# EAGLE design temperatur_sensor_childboard_v1 (EAGLE 6.3)
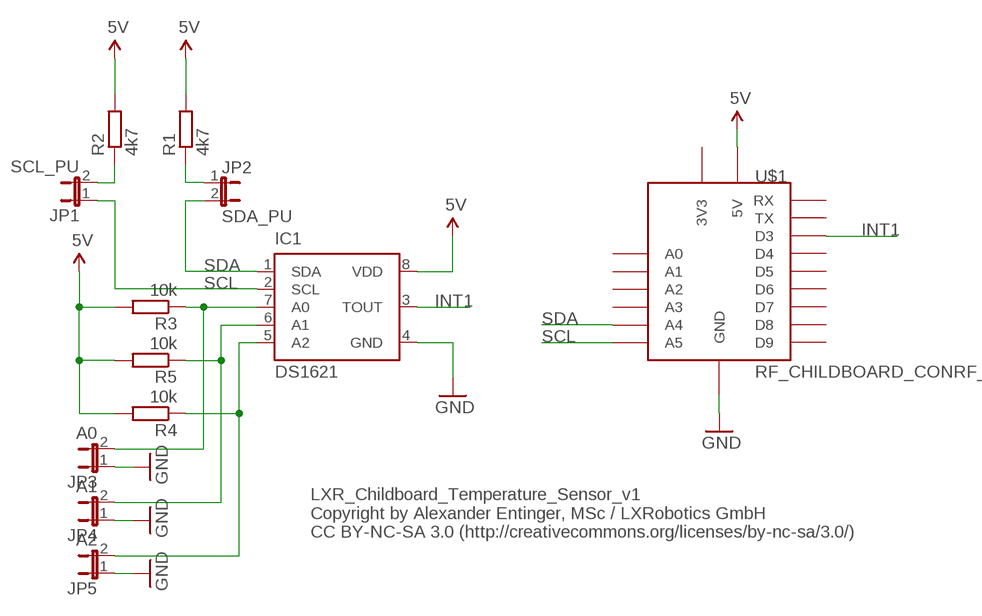
[diagram p0: schematic, sheet 1]

## Parts
IC1  DS1621  [DIL08]
JP1  SCL_PU  JP1E  [JP1]
JP2  SDA_PU  JP1E  [JP1]
JP3  A0  JP1E  [JP1]
JP4  A1  JP1E  [JP1]
JP5  A2  JP1E  [JP1]
R1  4k7  R-EU_0207/7  [0207/7]
R2  4k7  R-EU_0207/7  [0207/7]
R3  10k  R-EU_0207/7  [0207/7]
R4  10k  R-EU_0207/7  [0207/7]
R5  10k  R-EU_0207/7  [0207/7]
U$1  RF_CHILDBOARD_CONRF_C  [RF_CHILDBOARD_CON]

## Nets
5V: IC1.8(VDD) R1.2 R2.2 R3.2 R4.2 R5.2 U$1.5V
GND: IC1.4(GND) JP3.1 JP4.1 JP5.1 U$1.GND U$1.GND1(GND) U$1.GND2(GND)
INT1: IC1.3(TOUT) U$1.D3
N$1: JP1.2 R2.1
N$2: IC1.7(A0) JP3.2 R3.1
N$3: JP2.1 R1.1
N$4: IC1.6(A1) JP4.2 R5.1
N$5: IC1.5(A2) JP5.2 R4.1
SCL: IC1.2(SCL) JP1.1 U$1.A5
SDA: IC1.1(SDA) JP2.2 U$1.A4
Unconnected: U$1.3V3 U$1.A0 U$1.A1 U$1.A2 U$1.A3 U$1.D4 U$1.D5 U$1.D6 U$1.D7 U$1.D8 U$1.D9 U$1.RX U$1.TX

## Notes on the sheet
- LXR_Childboard_Temperature_Sensor_v1
  Copyright by Alexander Entinger, MSc / LXRobotics GmbH
  CC BY-NC-SA 3.0 (http://creativecommons.org/licenses/by-nc-sa/3.0/)

## Library data of the parts
IC1 = maxim:DS1621: Digital Thermometer and Thermostat Source: http://pdfserv.maxim-ic.com/en/ds/DS1621.pdf; MPN: DS1621; OC_FARNELL: 1188024; OC_NEWARK: 66F3769
JP1-JP5 = jumper:JP1E: JUMPER
R1-R5 = resistor:R-EU_: RESISTOR, European symbol
U$1 = lxrobotics:RF_CHILDBOARD_CON

## Board
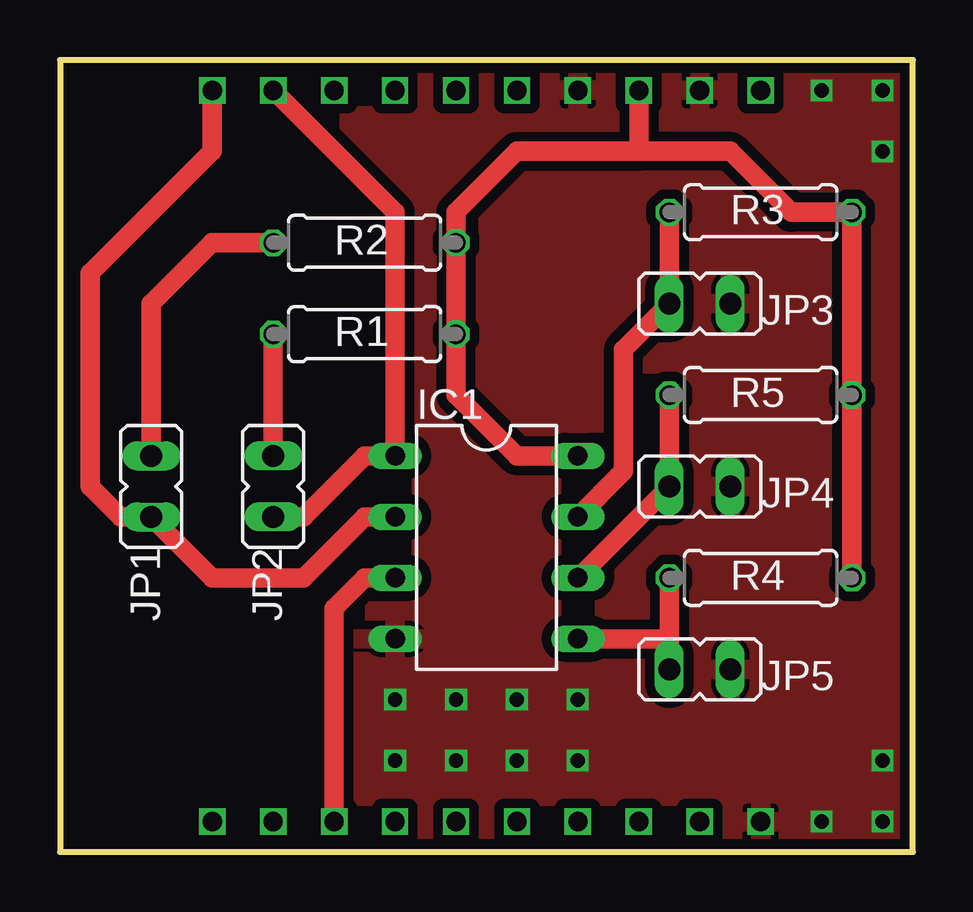
[diagram p1: board, top side]
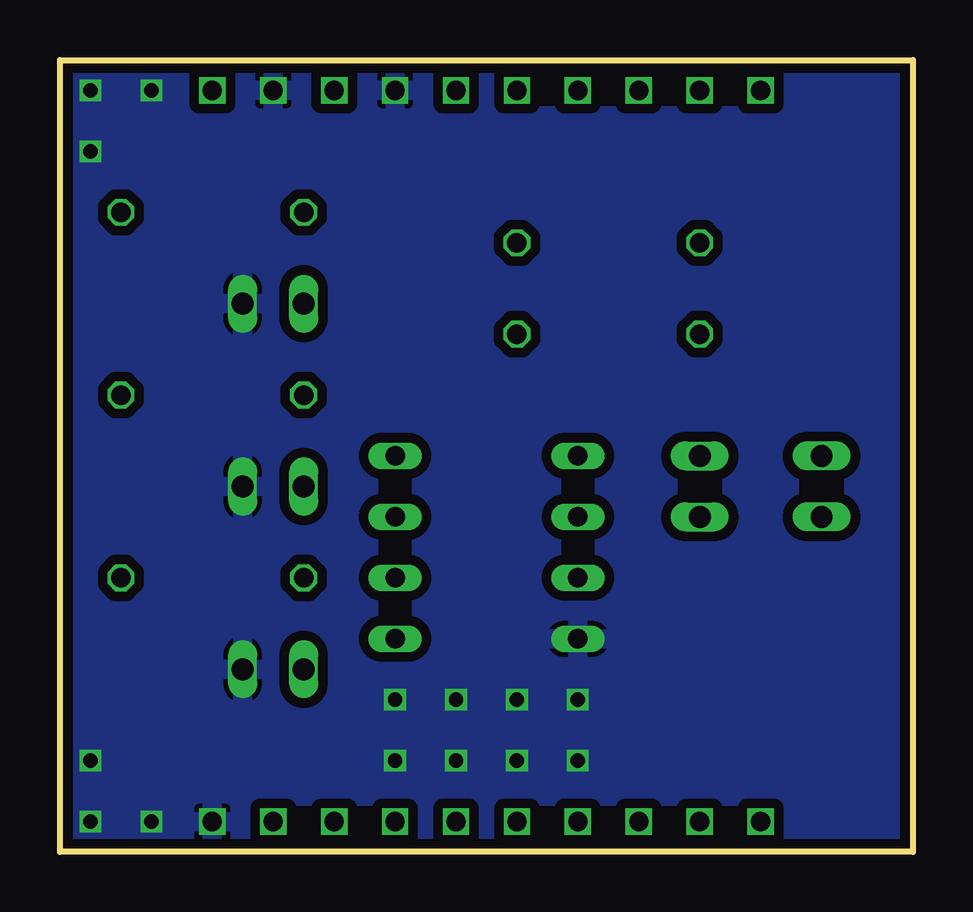
[diagram p2: board, bottom side, seen from below]

Size 35.56 x 33.02 mm. Coordinates in mm from the lower left corner, seen from the top.
Outline: 0,0 35.56,0 35.56,33.02 0,33.02 0,0
Copper layers (1*16): Top 0.035mm / dielectric 1.5mm / Bottom 0.035mm
Design rules "LeitOn - Standard-Eagle-DRU - 1- und  2-Lagen DK - deutsch - Rev 2.0": minimum track width 0.15mm, minimum drill 0.3mm, track to track 0.15mm, track to pad 0.15mm, pad to pad 0.15mm, via to via 0.15mm, smd to smd 0.15mm, copper to edge 0.3mm, drill to drill 0.3mm, minimum pad ring 0.15mm, minimum via ring 0.15mm, stop-mask expansion 0.075mm, vias tented up to drill 0mil, thermal gap 0.2mm

### Footprints (pad centres in the part's own frame; a part is rotated, then mirrored left to right if it is on the bottom)
DIL08 = drill 0.813 long: 1 -3.81,-3.81; 2 -1.27,-3.81; 3 1.27,-3.81; 4 3.81,-3.81; 5 3.81,3.81; 6 1.27,3.81; 7 -1.27,3.81; 8 -3.81,3.81
JP1 = drill 0.914 long: 1 0,-1.27; 2 0,1.27
0207/7 = drill 0.813 octagon: 1 -3.81,0; 2 3.81,0
RF_CHILDBOARD_CON = drill 0.8 square: 3V3 12.7,30.48; 5V 7.62,30.48; A0 2.54,30.48; A1 0,30.48; A2 -2.54,30.48; A3 -5.08,30.48; A4 -7.62,30.48; A5 -10.16,30.48; D3 -5.08,0; D4 -2.54,0; D5 0,0; D6 2.54,0; D7 5.08,0; D8 7.62,0; D9 10.16,0; GND 5.08,30.48; GND1 10.16,30.48; GND2 12.7,0; RX -10.16,0; TX -7.62,0

### Placement (x,y rotation side)
IC1  17.78,12.7 270 top
JP1  3.81,15.24 0 top
JP2  8.89,15.24 180 top
JP3  26.67,22.86 90 top
JP4  26.67,15.24 90 top
JP5  26.67,7.62 90 top
R1  12.7,21.59 0 top
R2  12.7,25.4 0 top
R3  29.21,26.67 0 top
R4  29.21,11.43 0 top
R5  29.21,19.05 0 top
U$1  16.51,1.27 0 top

### Tracks (layer width: path | path; a pad name or v marks a point on that pad's centre or on a via)
5V
  Top 0.813: R4.2 R5.2 R3.2 30.48,26.67 27.94,29.21 24.13,29.21 | U$1.5V 24.13,29.21 | IC1.8 19.05,16.51 16.51,19.05 R1.2 R2.2 16.51,26.67 19.05,29.21 24.13,29.21
GND  (via drill 0.6)
  other vias: 13.97,6.35 13.97,3.81 16.51,6.35 16.51,3.81 19.05,6.35 19.05,3.81 21.59,3.81 21.59,6.35 34.29,3.81 31.75,31.75 34.29,31.75 34.29,29.21 31.75,1.27 34.29,1.27
  pour Top (isolate 0.406): 0.63,0.63 34.93,0.63 34.93,32.38 0.63,32.38
  pour Bottom (isolate 0.406): 0.63,0.63 34.93,0.63 34.93,32.38 0.63,32.38
INT1
  Top 0.813: U$1.D3 11.43,10.16 12.7,11.43 IC1.3
N$1
  Top 0.813: JP1.2 3.81,22.86 6.35,25.4 R2.1
N$2
  Top 0.813: R3.1 JP3.2 23.49,20.95 23.49,15.87 IC1.7
N$3
  Top 0.813: R1.1 JP2.1
N$4
  Top 0.813: R5.1 JP4.2 IC1.6
N$5
  Top 0.813: R4.1 25.4,8.89 | 25.4,8.89 JP5.2 | IC1.5 25.4,8.89
SCL
  Top 0.813: IC1.2 12.7,13.97 10.16,11.43 6.35,11.43 JP1.1 2.54,13.97 1.27,15.24 1.27,24.13 6.35,29.21 U$1.A5
SDA
  Top 0.813: JP2.2 10.16,13.97 12.7,16.51 IC1.1 13.97,26.67 U$1.A4